# Altium schematic sheet 11-Ice40_FPGA.SchDoc
size B; SheetNumber: 11; SheetTotal: 12
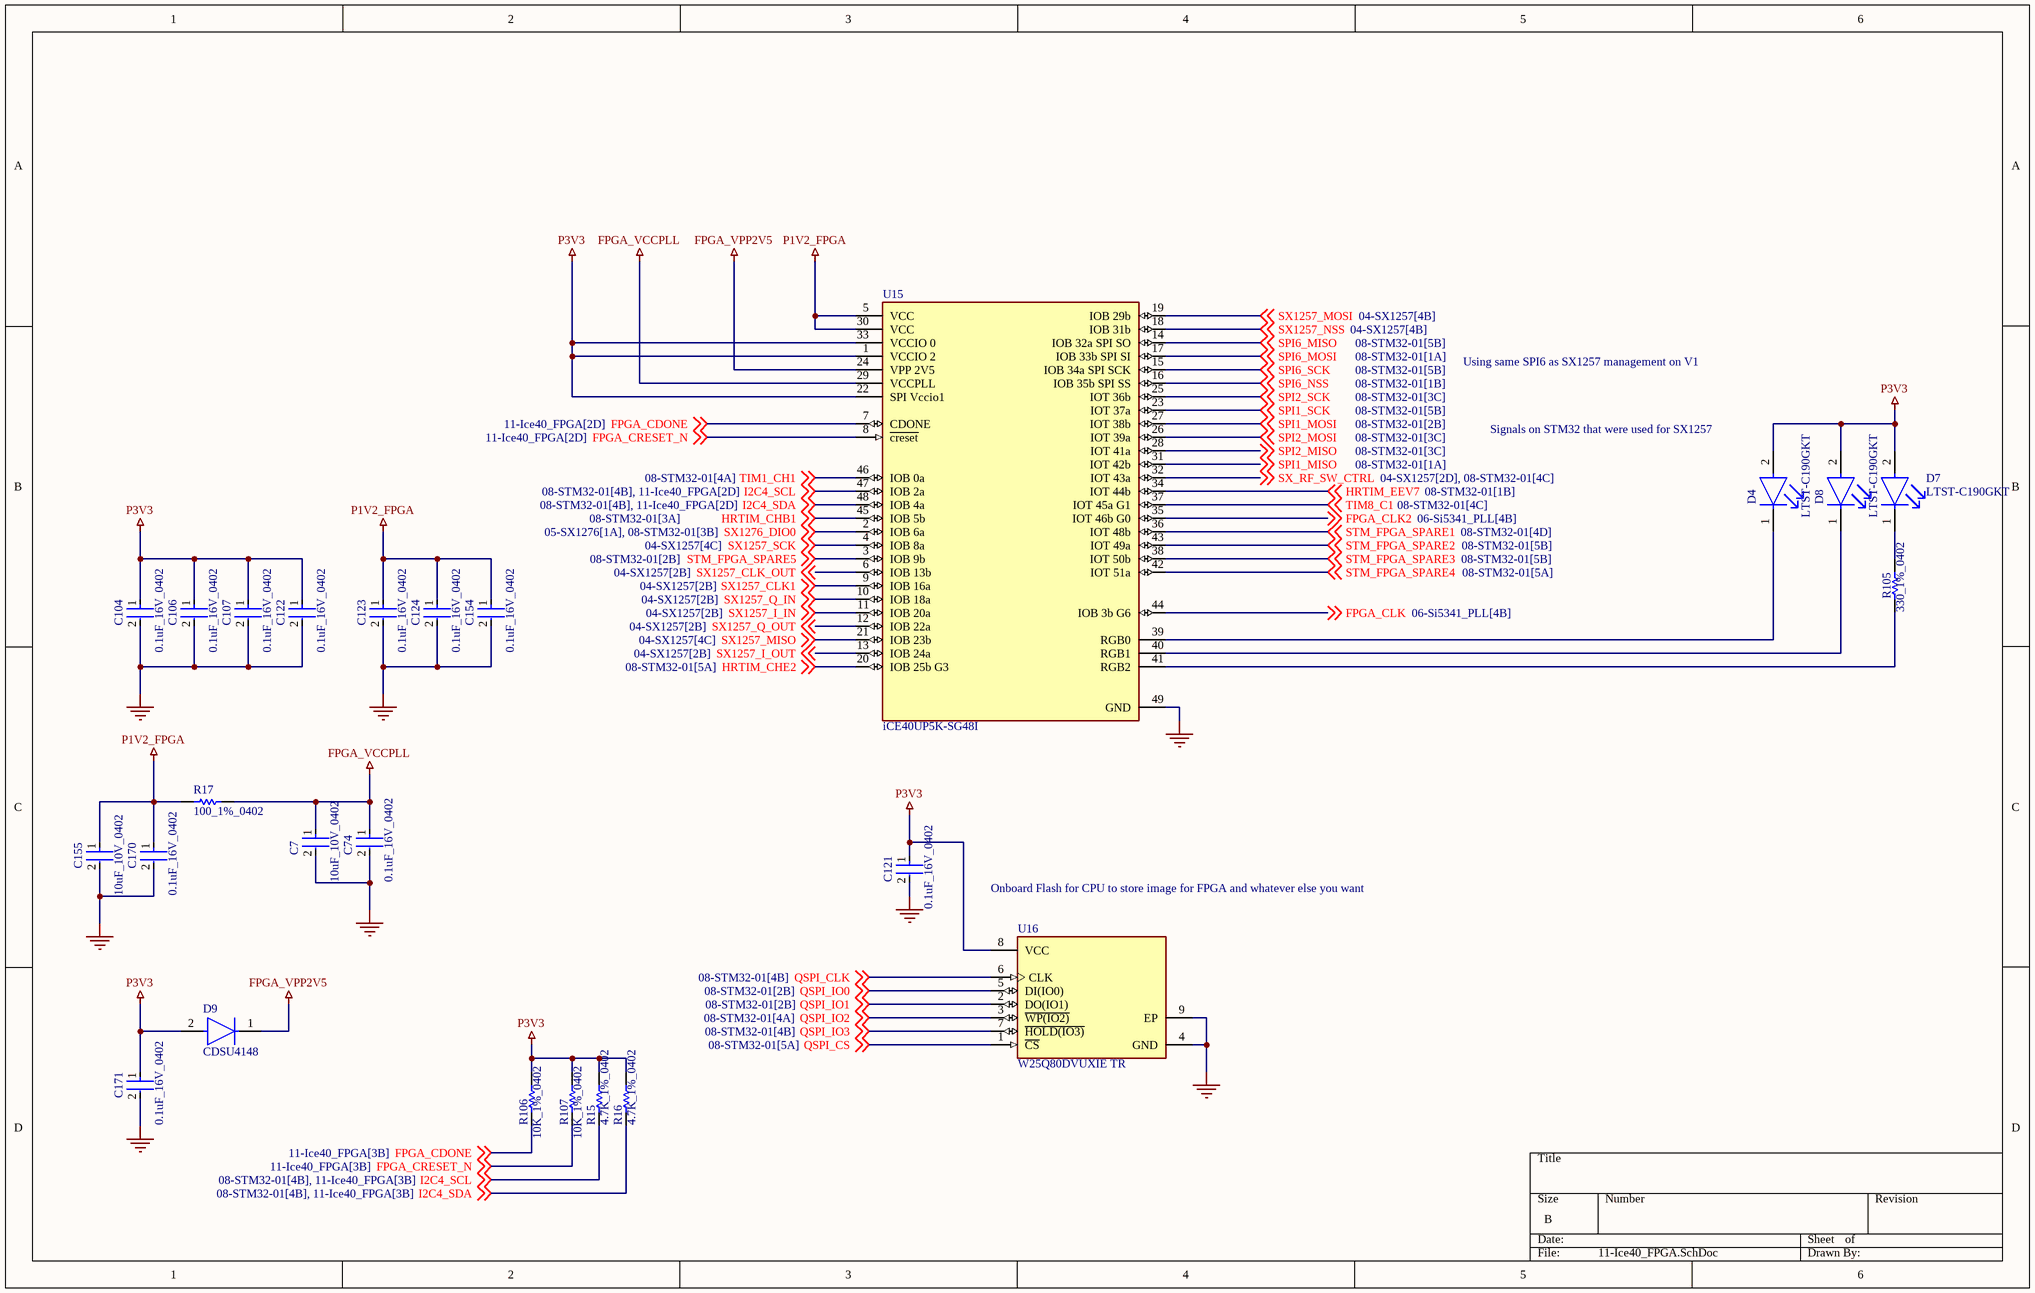
[diagram p0: 11-Ice40_FPGA.SchDoc]

## Parts
C7  10uF_10V_0402  [FP-CL05A106MP5NUNC-MFG]
C74  0.1uF_16V_0402  [FP-C0402-BB-MFG]
C104  0.1uF_16V_0402  [FP-C0402-BB-MFG]
C106  0.1uF_16V_0402  [FP-C0402-BB-MFG]
C107  0.1uF_16V_0402  [FP-C0402-BB-MFG]
C121  0.1uF_16V_0402  [FP-C0402-BB-MFG]
C122  0.1uF_16V_0402  [FP-C0402-BB-MFG]
C123  0.1uF_16V_0402  [FP-C0402-BB-MFG]
C124  0.1uF_16V_0402  [FP-C0402-BB-MFG]
C154  0.1uF_16V_0402  [FP-C0402-BB-MFG]
C155  10uF_10V_0402  [FP-CL05A106MP5NUNC-MFG]
C170  0.1uF_16V_0402  [FP-C0402-BB-MFG]
C171  0.1uF_16V_0402  [FP-C0402-BB-MFG]
D4  LTST-C190GKT  [FP-LTST-C190GKT-MFG]
D7  LTST-C190GKT  [FP-LTST-C190GKT-MFG]
D8  LTST-C190GKT  [FP-LTST-C190GKT-MFG]
D9  CDSU4148  [FP-0603-SOD-523F-MFG]
R15  4.7K_1%_0402  [RESC1005X40X25NL10T10]
R16  4.7K_1%_0402  [RESC1005X40X25NL10T10]
R17  100_1%_0402  [RESC1005X40X25LL05T05]
R105  330_1%_0402  [RESC1005X40X25NL10T10]
R106  10K_1%_0402  [RESC1005X40X25NL10T10]
R107  10K_1%_0402  [RESC1005X40X25NL10T10]
U15  iCE40UP5K-SG48I  [FP-QFN-48-IPC_C]
U16  W25Q80DVUXIE TR  [FP-UX-MFG]

## Nets
FPGA_VCCPLL: C7.1 C74.1 R17.2 U15.29(VCCPLL)
FPGA_VPP2V5: D9.1(C) U15.24(VPP_2V5)
GND: C7.2 C74.2 C104.2 C106.2 C107.2 C121.2 C122.2 C123.2 C124.2 C154.2 C155.2 C170.2 C171.2 U15.49(GND) U16.4(GND) U16.9(EP)
P1V2_FPGA: C123.1 C124.1 C154.1 C155.1 C170.1 R17.1 U15.5(VCC) U15.30(VCC)
P3V3: C104.1 C106.1 C107.1 C121.1 C122.1 C171.1 D4.2(A) D7.2(A) D8.2(A) D9.2(A) R15.2 R16.2 R106.2 R107.2 U15.1(VCCIO_2) U15.22(SPI_Vccio1) U15.33(VCCIO_0) U16.8(VCC)
FPGA_CDONE: R106.1 U15.7(CDONE) ; off-sheet FPGA_CDONE
FPGA_CLK: U15.44(IOB_3b_G6) ; off-sheet FPGA_CLK
FPGA_CLK2: U15.35(IOT_46b_G0) ; off-sheet FPGA_CLK2
FPGA_CRESET_N: R107.1 U15.8(~{creset}) ; off-sheet FPGA_CRESET_N
HRTIM_CHB1: U15.45(IOB_5b) ; off-sheet HRTIM_CHB1
HRTIM_CHE2: U15.20(IOB_25b_G3) ; off-sheet HRTIM_CHE2
HRTIM_EEV7: U15.34(IOT_44b) ; off-sheet HRTIM_EEV7
I2C4_SCL: R15.1 U15.47(IOB_2a) ; off-sheet I2C4_SCL
I2C4_SDA: R16.1 U15.48(IOB_4a) ; off-sheet I2C4_SDA
QSPI_CLK: U16.6(CLK) ; off-sheet QSPI_CLK
QSPI_CS: U16.1(~{CS}) ; off-sheet QSPI_CS
QSPI_IO0: U16.5(DI(IO0)) ; off-sheet QSPI_IO0
QSPI_IO1: U16.2(DO(IO1)) ; off-sheet QSPI_IO1
QSPI_IO2: U16.3(~{WP(IO2)}) ; off-sheet QSPI_IO2
QSPI_IO3: U16.7(~{HOLD(IO3)}) ; off-sheet QSPI_IO3
SPI1_MISO: U15.31(IOT_42b) ; off-sheet SPI1_MISO
SPI1_MOSI: U15.27(IOT_38b) ; off-sheet SPI1_MOSI
SPI1_SCK: U15.23(IOT_37a) ; off-sheet SPI1_SCK
SPI2_MISO: U15.28(IOT_41a) ; off-sheet SPI2_MISO
SPI2_MOSI: U15.26(IOT_39a) ; off-sheet SPI2_MOSI
SPI2_SCK: U15.25(IOT_36b) ; off-sheet SPI2_SCK
SPI6_MISO: U15.14(IOB_32a_SPI_SO) ; off-sheet SPI6_MISO
SPI6_MOSI: U15.17(IOB_33b_SPI_SI) ; off-sheet SPI6_MOSI
SPI6_NSS: U15.16(IOB_35b_SPI_SS) ; off-sheet SPI6_NSS
SPI6_SCK: U15.15(IOB_34a_SPI_SCK) ; off-sheet SPI6_SCK
STM_FPGA_SPARE1: U15.36(IOT_48b) ; off-sheet STM_FPGA_SPARE1
STM_FPGA_SPARE2: U15.43(IOT_49a) ; off-sheet STM_FPGA_SPARE2
STM_FPGA_SPARE3: U15.38(IOT_50b) ; off-sheet STM_FPGA_SPARE3
STM_FPGA_SPARE4: U15.42(IOT_51a) ; off-sheet STM_FPGA_SPARE4
STM_FPGA_SPARE5: U15.3(IOB_9b) ; off-sheet STM_FPGA_SPARE5
SX1257_CLK1: U15.9(IOB_16a) ; off-sheet SX1257_CLK1
SX1257_CLK_OUT: U15.6(IOB_13b) ; off-sheet SX1257_CLK_OUT
SX1257_I_IN: U15.11(IOB_20a) ; off-sheet SX1257_I_IN
SX1257_I_OUT: U15.13(IOB_24a) ; off-sheet SX1257_I_OUT
SX1257_MISO: U15.21(IOB_23b) ; off-sheet SX1257_MISO
SX1257_MOSI: U15.19(IOB_29b) ; off-sheet SX1257_MOSI
SX1257_NSS: U15.18(IOB_31b) ; off-sheet SX1257_NSS
SX1257_Q_IN: U15.10(IOB_18a) ; off-sheet SX1257_Q_IN
SX1257_Q_OUT: U15.12(IOB_22a) ; off-sheet SX1257_Q_OUT
SX1257_SCK: U15.4(IOB_8a) ; off-sheet SX1257_SCK
SX1276_DIO0: U15.2(IOB_6a) ; off-sheet SX1276_DIO0
SX_RF_SW_CTRL: U15.32(IOT_43a) ; off-sheet SX_RF_SW_CTRL
TIM1_CH1: U15.46(IOB_0a) ; off-sheet TIM1_CH1
TIM8_C1: U15.37(IOT_45a_G1) ; off-sheet TIM8_C1
NetD4_1: D4.1(C) U15.39(RGB0)
NetD7_1: D7.1(C) R105.2
NetD8_1: D8.1(C) U15.40(RGB1)
NetR105_1: R105.1 U15.41(RGB2)

## Notes on the sheet
- Using same SPI6 as SX1257 management on V1
- (near D4) Signals on STM32 that were used for SX1257
- Onboard Flash for CPU to store image for FPGA and whatever else you want

## Library data of the parts
C7 C155 = CMP-13271-000002-1: CAP CER 10UF 10V X5R 0402; Manufacturer Part Number: CL05A106MP5NUNC; Manufacturer: Samsung; Temperature Coefficient: 15%; Tolerance: 20%; Material: Ceramic; Octopart: https://octopart.com/cl05a106mp5nunc-samsung-22457395; Voltage Rating: 10V; RoHS: TRUE; Value: 10uF; Height: 0.7mm; Digikey Description: CAP CER 10UF 10V X5R 0402; Automotive: No; Package: CL05A106MP5NUNC; Device Class L1: Passive Components; Capacitance: 10uF; Temperature Range High: +85°C; ComponentLink2Description: Datasheet; Device Class L2: Capacitors; Temperature Characteristic: X5R; Temperature: -55°C to +85°C; ComponentLink2URL: http://www.samsungsem.com/kr/support/product-search/mlcc/__icsFiles/afieldfile/2019/05/10/19-CL05A106MP5NUNC.pdf; Device Class L3: Ceramic Capacitors; Category: Cap; Temperature Range Low: -55°C; Ipc Land Pattern Name: CAPC10050X50; Lead Free: Yes
C74 C104 C106 C107 C121-C124 C154 C170 C171 = CMP-1034-02068-3: CAP CER 0.1UF 16V 5% X7R 0402; Manufacturer: Kemet; Manufacturer Part Number: C0402C104J4RACTU; Value: 0.10 μF; Temperature Coefficient: 15%; Tolerance: 0.05; Material: Ceramic; ComponentLink2URL: https://content.kemet.com/datasheets/KEM_C1002_X7R_SMD.pdf; Automotive: No; Device Class L2: Capacitors; Temperature: -55°C to +125°C; RoHS: TRUE; Voltage Rating: 16 V; ComponentLink2Description: Datasheet; Device Class L3: Ceramic Capacitors; Temperature Range Low: -55°C; Ipc Land Pattern Name: CAPC10050X50; Device Class L1: Passive Components; Temperature Range High: +125°C; Package: C0402-BB; Capacitance: 0.10 μF; Category: Cap; Mouser Description: CAP CER 0.1UF 16V X7R 0402; Height: 0.55mm; Digikey Description: CAP CER 0.1UF 16V 5% X7R 0402; Octopart: https://octopart.com/c0402c104j4ractu-kemet-12573893; Temperature Characteristic: X7R; Lead Free: Yes
D4 D7 D8 = CMP-22017-000005-2: LED GREEN CLEAR CHIP SMD; Dominant Wavelength: 569nm; Reverse Voltage: 5V; Lens Color: Colorless; Viewing Angle: 130°; Voltage: 2V; Forward Current: 30mA; Power Dissipation: 100mW; Luminous Intensity: 6mcd; Number of LEDs: 1; Forward Voltage: 2.1V; Wavelength: 565nm; Test Current: 10mA; Min Operating Temperature: -55°C; Lens Style: Clear; Mount: Surface Mount; Width: 0.8mm; Packaging: Tape and Reel; Lens Transparency: Clear; Case Code (Metric): 1608; Depth: 0.8mm; Case Code (Imperial): 0603; Case/Package: 0603; Number of Pins: 2; Max Operating Temperature: 85°C; Lead Free: Lead Free; Number of Elements: 1; Length: 1.6mm; Height: 0.8mm; Package Quantity: 1; Power Rating: 100mW; Radiation Hardening: No; Illumination Color: Green; Color: Green
D9 = CMP-20228-000007-1: DIODE GEN PURP 75V 150MA 0603; Reverse Recovery Time: 4ns; Max Reverse Leakage Current: 2.5uA; Max Surge Current: 4A; Capacitance: 3pF; Current Rating: 100mA; Max Power Dissipation: 150mW; Polarity: Standard; Voltage Rating (DC): 75V; Average Rectified Current: 150mA; Packaging: Tape and Reel; Recovery Time: 4ns; Max Reverse Voltage (DC): 75V; Output Current: 100mA; Case/Package: SMD/SMT; Mount: Surface Mount; Lead Free: Lead Free; Package Quantity: 1
R15 R16 = CMP-2002-05217-1: Manufacturer: Bourns; Part Number: CR0402-FX-4701GLF
R17 = CMP-2002-00605-3: Chip Resistor, 100 Ohm, +/- 1%, 100 mW, -55 to 155 degC, 0402 (1005 Metric), RoHS, Tape and Reel; Manufacturer: Basic Passives; PartNumber: ERJ-2RKF1000X; Power Rating: 100 mW; Resistance: 100 Ohm; Voltage Rating: 50 V; Case\/Package: 0402; Width: 0.5 mm; Pins: 2; ComponentLink2Description: Datasheet; PackageReference: 0402; Height: 0.35 mm; Tolerance: 1%; DatasheetVersion: 04/2015; Case Code (Imperial): 0402; Min Operating Temperature: -55 degC; Radiation Hardening: No; Length: 1 mm; Package Quantity: 10000; PackageDescription: 2-Pin Surface Mount Device, Body 1 x 0.5 mm; Mounting Technology: Surface Mount; Case Code (Metric): 1005; Packaging: Tape and Reel; ComponentLink1URL: http://www.panasonic.com/; RoHSCompliant: true; Max Operating Temperature: 155 degC; REACH SVHC: Yes; ComponentLink1Description: Manufacturer URL; ComponentLink2URL: http://industrial.panasonic.com/cdbs/www-data/pdf/RDA0000/AOA0000C86.pdf; Mount: Surface Mount
R105 = CMP-2002-05853-1: Manufacturer: Panasonic; Part Number: ERA-2AED331X
R106 R107 = CMP-2002-04694-1: Manufacturer: Bourns; Part Number: CR0402-FX-1002GLF
U15 = CMP-17932-000001-1: ICE40-ULTRAPLUS, 5280 LUTS, 1.2V; Manufacturer: Lattice; Propagation Delay: 9ns; Frequency: 48MHz; Max Junction Temp: +100°C; Ram Size: 1024Kbits; Number Of Logic Elements Cells: 5280; Number Of I/Os: 39; Max Supply Voltage: 3.46V; Standoff Height: 0mm; Nominal Supply Current: 2.5-12mA; Min Supply Voltage: 1.14V; Number Of Logic Blocks: 660; Device Class L3: FPGAs - Field Programmable Gate Arrays; Temperature Range High: +100°C; Device Class L1: Integrated Circuits (ICs); Device Class L2: Embedded Processors and Controllers; Ipc Land Pattern Name: QFN50P700X700X90-48; Automotive: No; RoHS: TRUE; Lead Free: Yes; Height: 1mm; ComponentLink2Description: Datasheet; Manufacturer Part Number: iCE40UP5K-SG48I; Temperature Range Low: -40°C; Package: QFN-48; Temperature: -40°C to +100°C; Octopart: https://octopart.com/ice40up5k-sg48i-lattice+semiconductor-87369311; Footprint Url: http://www.latticesemi.com/view_document?document_id=213; Digikey Description: ICE40-ULTRAPLUS, 5280 LUTS, 1.2V; ComponentLink2URL: http://www.latticesemi.com/view_document?document_id=51968; Category: IC
U16 = CMP-78876-000004-1: IC FLASH 8M SPI 104MHZ 8USON; Memory Size: 8Mb; Memory Type: Non-Volatile; Mount: Surface Mount; Frequency: 104MHz; Min Operating Temperature: -40°C; Max Operating Temperature: 85°C; Packaging: Tape and Reel